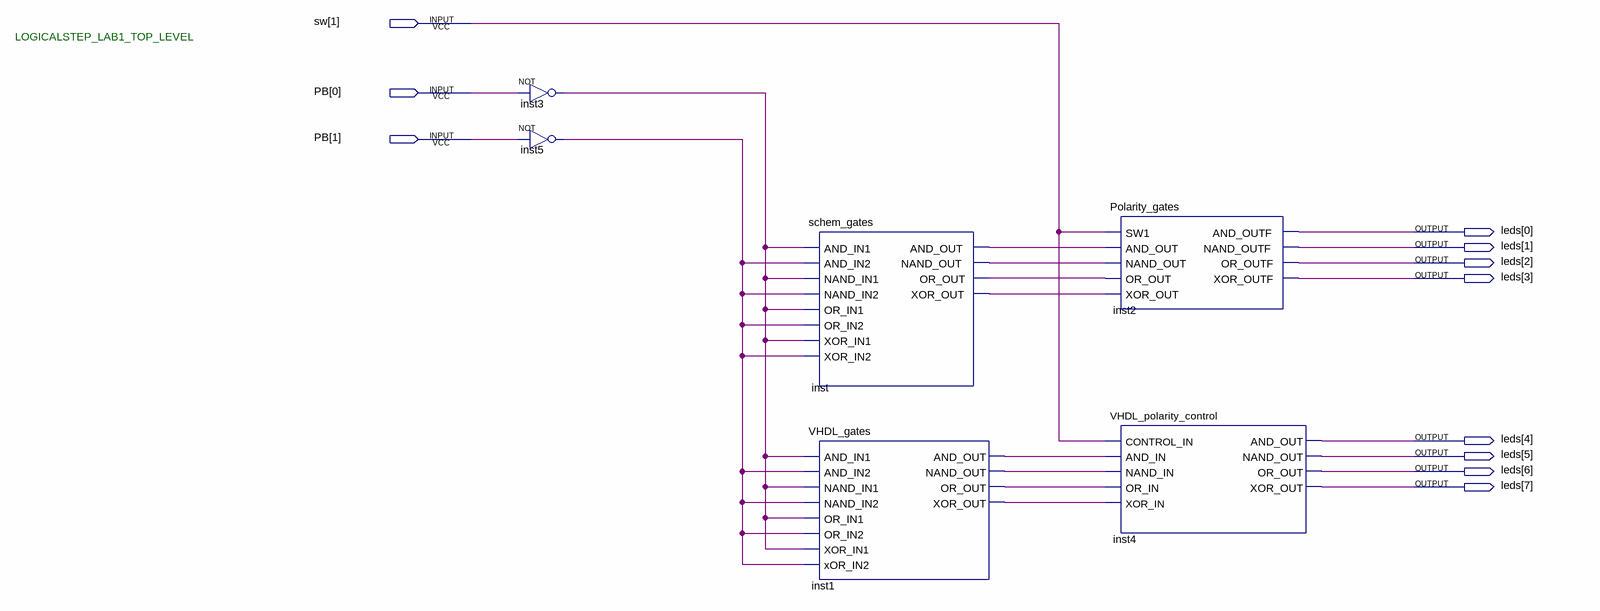
[diagram p0: schematic sheet]
// Quartus schematic LogicalStep_Lab1_top.bdf as structural Verilog: 6 symbols, 11 pins
module LogicalStep_Lab1_top (
  input  [1:1] sw,
  input  [1:0] PB,
  output [7:0] leds
);

  wire inst1_and_out, inst1_nand_out, inst1_or_out, inst1_xor_out, inst3_out, inst5_out, inst_and_out,
       inst_nand_out, inst_or_out, inst_xor_out;

  not inst3 (inst3_out, PB[0]);
  not inst5 (inst5_out, PB[1]);
  schem_gates inst (
    .AND_IN1(inst3_out), .AND_IN2(inst5_out), .NAND_IN1(inst3_out), .NAND_IN2(inst5_out), .OR_IN1(inst3_out),
    .OR_IN2(inst5_out), .XOR_IN1(inst3_out), .XOR_IN2(inst5_out), .AND_OUT(inst_and_out),
    .NAND_OUT(inst_nand_out), .OR_OUT(inst_or_out), .XOR_OUT(inst_xor_out));
  VHDL_gates inst1 (
    .AND_IN1(inst3_out), .AND_IN2(inst5_out), .NAND_IN1(inst3_out), .NAND_IN2(inst5_out), .OR_IN1(inst3_out),
    .OR_IN2(inst5_out), .XOR_IN1(inst3_out), .xOR_IN2(inst5_out), .AND_OUT(inst1_and_out),
    .NAND_OUT(inst1_nand_out), .OR_OUT(inst1_or_out), .XOR_OUT(inst1_xor_out));
  Polarity_gates inst2 (
    .SW1(sw[1]), .AND_OUT(inst_and_out), .NAND_OUT(inst_nand_out), .OR_OUT(inst_or_out),
    .XOR_OUT(inst_xor_out), .AND_OUTF(leds[0]), .NAND_OUTF(leds[1]), .OR_OUTF(leds[2]), .XOR_OUTF(leds[3]));
  VHDL_polarity_control inst4 (
    .CONTROL_IN(sw[1]), .AND_IN(inst1_and_out), .NAND_IN(inst1_nand_out), .OR_IN(inst1_or_out),
    .XOR_IN(inst1_xor_out), .AND_OUT(leds[4]), .NAND_OUT(leds[5]), .OR_OUT(leds[6]), .XOR_OUT(leds[7]));

  // Notes on the sheet:
  //   LOGICALSTEP_LAB1_TOP_LEVEL
endmodule
